# EAGLE design DSPLIT_v0.2 (EAGLE 6.5.0)
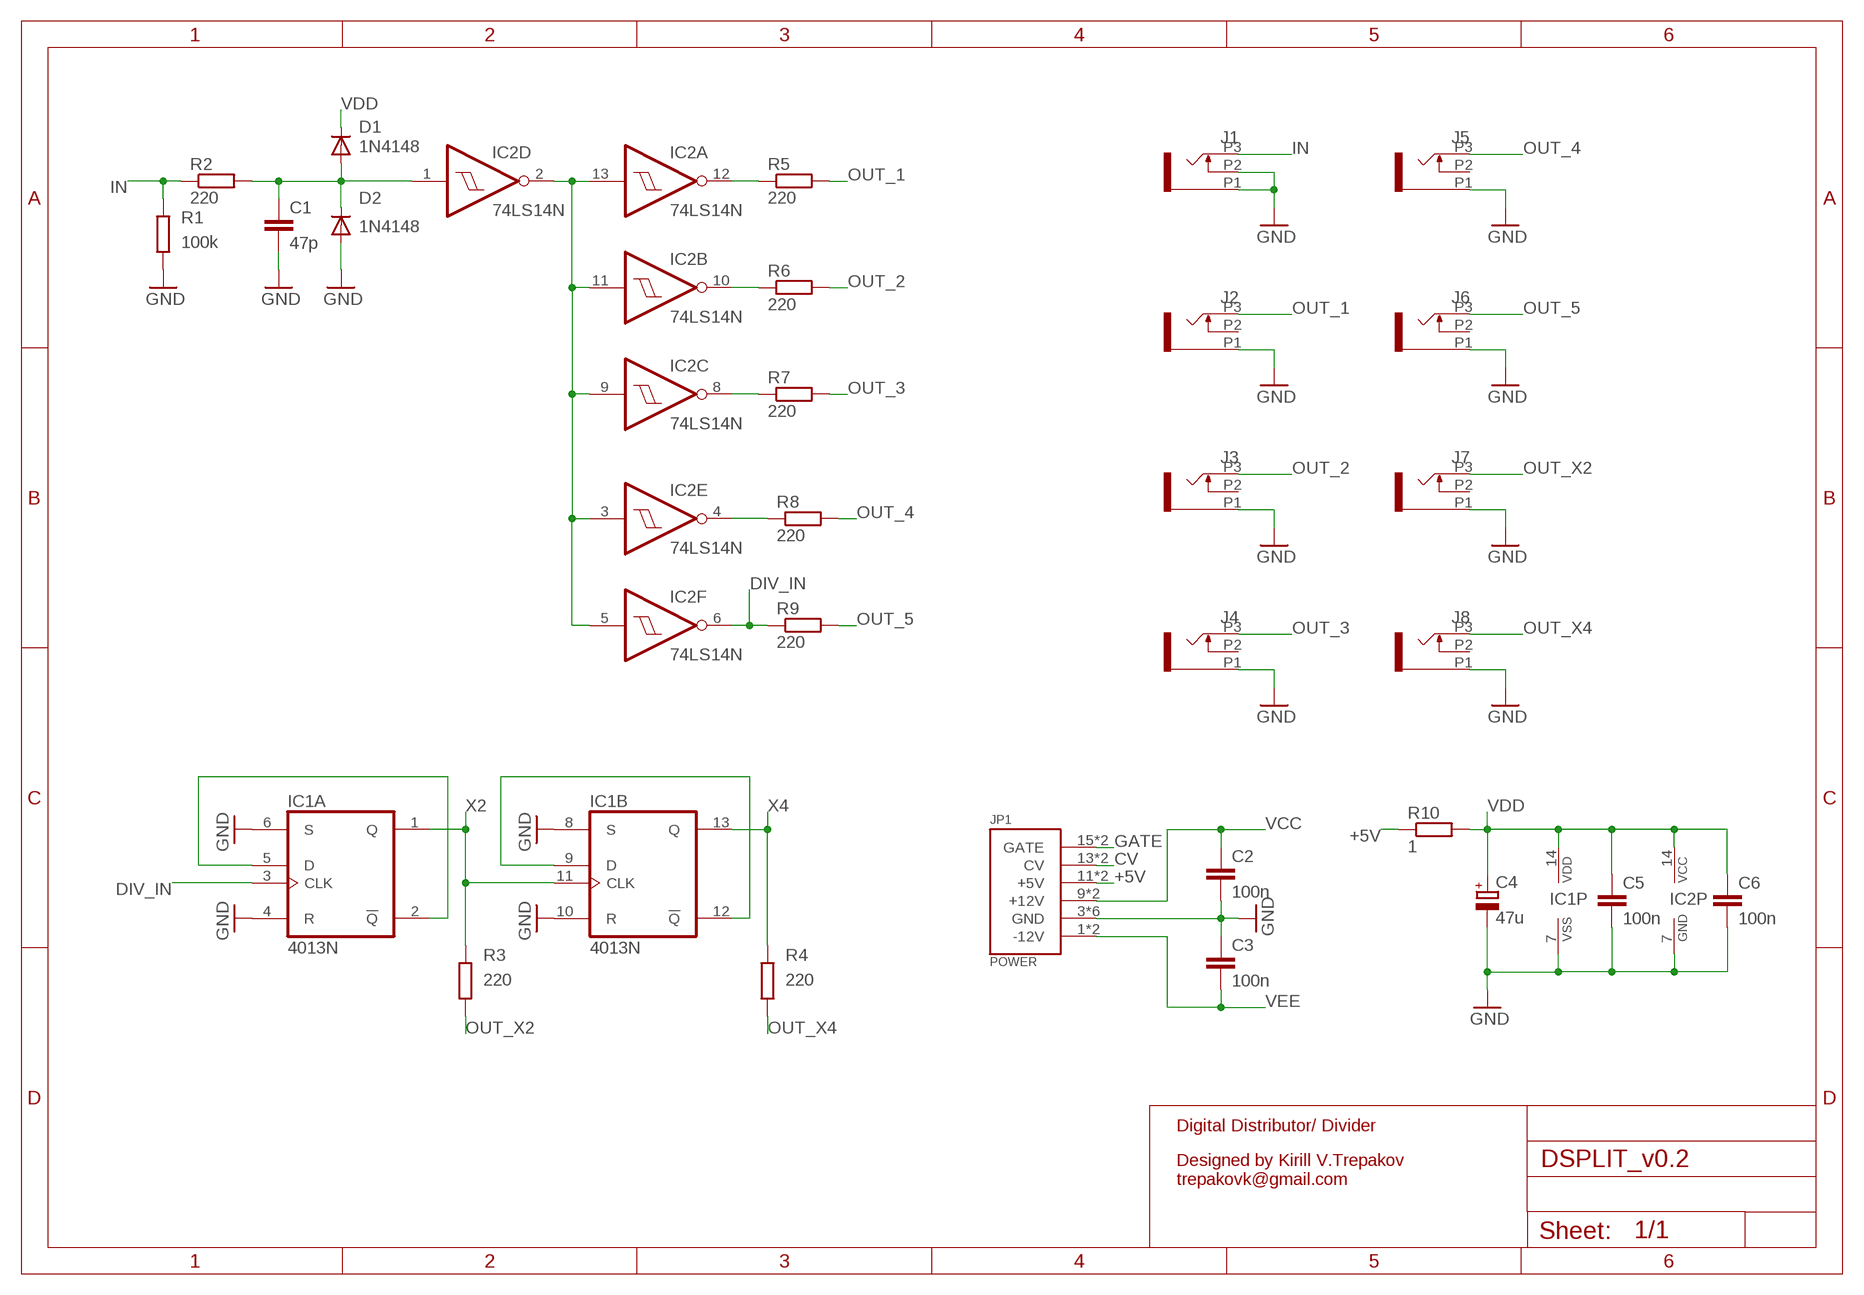
[diagram p0: schematic, sheet 1]

## Parts
C1  47p  C-EU050-024X044  [C050-024X044]
C2  100n  C-EU050-024X044  [C050-024X044]
C3  100n  C-EU050-024X044  [C050-024X044]
C4  47u  CPOL-EUE2.5-6  [E2,5-6]
C5  100n  C-EU050-024X044  [C050-024X044]
C6  100n  C-EU050-024X044  [C050-024X044]
D1  1N4148  1N4148DO35-7  [DO35-7]
D2  1N4148  1N4148DO35-7  [DO35-7]
IC1  4013N  [DIL14]
IC2  74LS14N  [DIL14]
J1  WQP-PJ302M_JACK  [WQP-PJ302M_JACK]
J2  WQP-PJ302M_JACK  [WQP-PJ302M_JACK]
J3  WQP-PJ302M_JACK  [WQP-PJ302M_JACK]
J4  WQP-PJ302M_JACK  [WQP-PJ302M_JACK]
J5  WQP-PJ302M_JACK  [WQP-PJ302M_JACK]
J6  WQP-PJ302M_JACK  [WQP-PJ302M_JACK]
J7  WQP-PJ302M_JACK  [WQP-PJ302M_JACK]
J8  WQP-PJ302M_JACK  [WQP-PJ302M_JACK]
JP1  POWER  POWER"  [POWER_16]
R1  100k  R-EU_0204/7  [0204/7]
R2  220  R-EU_0204/7  [0204/7]
R3  220  R-EU_0204/7  [0204/7]
R4  220  R-EU_0204/7  [0204/7]
R5  220  R-EU_0204/7  [0204/7]
R6  220  R-EU_0204/7  [0204/7]
R7  220  R-EU_0204/7  [0204/7]
R8  220  R-EU_0204/7  [0204/7]
R9  220  R-EU_0204/7  [0204/7]
R10  1  R-EU_0204/7  [0204/7]

## Nets
+5V: JP1.11(+5V) JP1.12(+5V) R10.1
CV: JP1.13(CV) JP1.14(CV)
DIV_IN: IC1.3(A:CLK) IC2.6(F:O) R9.1
GATE: JP1.15(GATE) JP1.16(GATE)
GND: C1.2 C2.2 C3.1 C4.- C5.2 C6.2 D2.A IC1.4(A:R) IC1.6(A:S) IC1.7(P:VSS) IC1.8(B:S) IC1.10(B:R) IC2.7(P:GND) J1.P1 J1.P2 J2.P1 J3.P1 J4.P1 J5.P1 J6.P1 J7.P1 J8.P1 JP1.3(GND) JP1.4(GND) JP1.5(GND) JP1.6(GND) JP1.7(GND) JP1.8(GND) R1.1
IN: J1.P3 R1.2 R2.1
IN_1_: C1.1 D1.A D2.C IC2.1(D:I) R2.2
N$1: IC1.2(A:!Q) IC1.5(A:D)
N$2: IC2.2(D:O) IC2.3(E:I) IC2.5(F:I) IC2.9(C:I) IC2.11(B:I) IC2.13(A:I)
N$3: IC1.9(B:D) IC1.12(B:!Q)
N$10: IC2.12(A:O) R5.1
N$11: IC2.10(B:O) R6.1
N$12: IC2.8(C:O) R7.1
N$13: IC2.4(E:O) R8.1
OUT_1: J2.P3 R5.2
OUT_2: J3.P3 R6.2
OUT_3: J4.P3 R7.2
OUT_4: J5.P3 R8.2
OUT_5: J6.P3 R9.2
OUT_X2: J7.P3 R3.2
OUT_X4: J8.P3 R4.2
VCC: C2.1 JP1.9(+12V) JP1.10(+12V)
VDD: C4.+ C5.1 C6.1 D1.C IC1.14(P:VDD) IC2.14(P:VCC) R10.2
VEE: C3.2 JP1.1(-12V) JP1.2(-12V)
X2: IC1.1(A:Q) IC1.11(B:CLK) R3.1
X4: IC1.13(B:Q) R4.1
Unconnected: J2.P2 J3.P2 J4.P2 J5.P2 J6.P2 J7.P2 J8.P2

## Notes on the sheet
- Digital Distributor/ Divider
- Designed by Kirill V.Trepakov
  trepakovk@gmail.com

## Library data of the parts
C1-C3 C5 C6 = rcl:C-EU: CAPACITOR, European symbol
C4 = rcl:CPOL-EU: POLARIZED CAPACITOR, European symbol
D1 D2 = _motovilo:1N4148: DIODE high speed (Philips)
IC1 = 40xx:4013: Dual D FLIP FLOP, set/reset
IC2 = 74xx-eu:74*14: Hex schmitt trigger INVERTER
J1-J8 = _mtvl.connectors:WQP-PJ302M_JACK
JP1 = _motovilo:POWER
R1-R10 = rcl:R-EU_: RESISTOR, European symbol

## Board
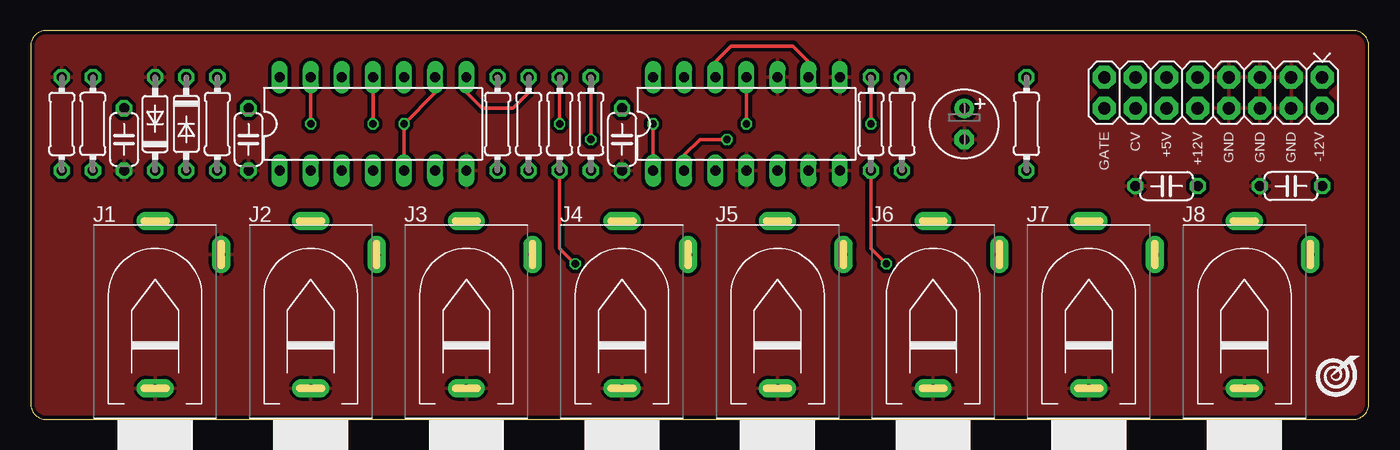
[diagram p1: board, top side]
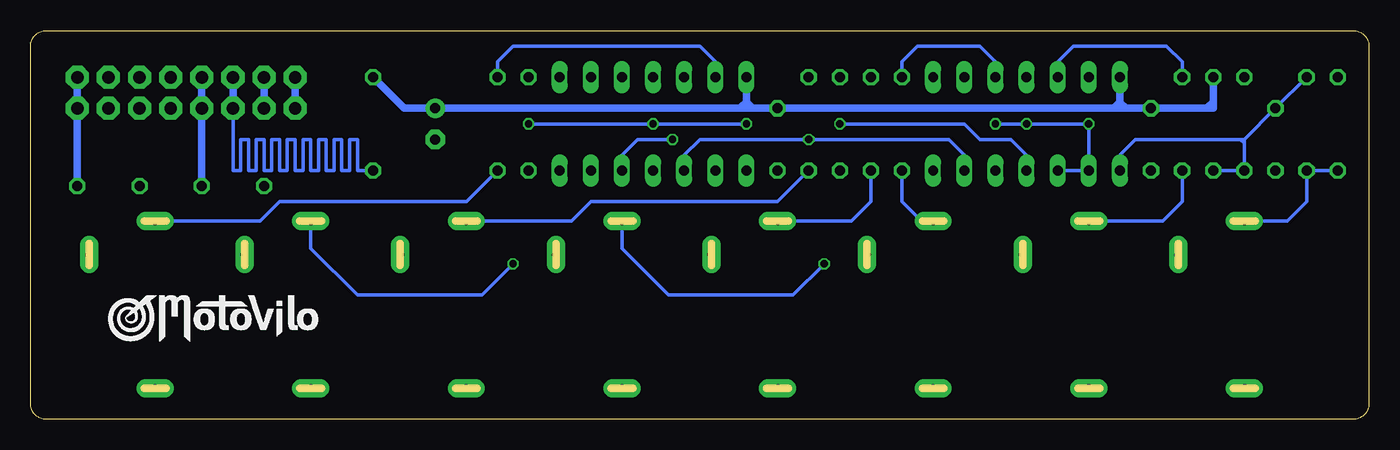
[diagram p2: board, bottom side, seen from below]

Size 109.22 x 31.75 mm. Coordinates in mm from the lower left corner, seen from the top.
Outline: 0,30.48 0,1.27 arc90 1.27,0 107.95,0 arc90 109.22,1.27 109.22,30.48 arc90 107.95,31.75 1.27,31.75 arc90 0,30.48
Copper layers (1*16): Top 0.035mm / dielectric 1.5mm / Bottom 0.035mm
Design rules "ITEADstudio_DRC_z *": minimum track width 6mil, minimum drill 12mil, track to track 10mil, track to pad 10mil, pad to pad 10mil, via to via 10mil, smd to smd 0mil, copper to edge 10mil, drill to drill 10mil, minimum pad ring 10mil, minimum via ring 6mil, stop-mask expansion 2mil, vias tented up to drill 100mil, thermal gap 10mil

### Footprints (pad centres in the part's own frame; a part is rotated, then mirrored left to right if it is on the bottom)
C050-024X044 = drill 0.813 octagon: 1 -2.54,0; 2 2.54,0
E2,5-6 = drill 0.813 pad 1.6: + -1.27,0 | drill 0.813 pad 1.6 octagon: - 1.27,0
DO35-7 = drill 0.813 octagon: A 3.81,0; C -3.81,0
DIL14 = drill 0.813 long: 1 -7.62,-3.81; 2 -5.08,-3.81; 3 -2.54,-3.81; 4 0,-3.81; 5 2.54,-3.81; 6 5.08,-3.81; 7 7.62,-3.81; 8 7.62,3.81; 9 5.08,3.81; 10 2.54,3.81; 11 0,3.81; 12 -2.54,3.81; 13 -5.08,3.81; 14 -7.62,3.81
WQP-PJ302M_JACK = drill 0.61 pad 1.524 long: P1 0,-5.08; P2 5.397,5.842; P3 0,8.572
POWER_16 = drill 1.016 pad 1.88 octagon: 1 1.27,-8.89; 2 -1.27,-8.89; 3 1.27,-6.35; 4 -1.27,-6.35; 5 1.27,-3.81; 6 -1.27,-3.81; 7 1.27,-1.27; 8 -1.27,-1.27; 9 1.27,1.27; 10 -1.27,1.27; 11 1.27,3.81; 12 -1.27,3.81; 13 1.27,6.35; 14 -1.27,6.35; 15 1.27,8.89; 16 -1.27,8.89
0204/7 = drill 0.813 octagon: 1 -3.81,0; 2 3.81,0

### Placement (x,y rotation side)
C1  7.62,22.86 270 top
C2  92.71,19.05 180 top
C3  102.87,19.05 0 top
C4  76.2,24.13 270 top
C5  17.78,22.86 270 top
C6  48.26,22.86 270 top
D1  12.7,24.13 270 top
D2  10.16,24.13 90 top
IC1  58.42,24.13 0 top
IC2  27.94,24.13 0 top
J1  10.16,7.62 0 top
J2  22.86,7.62 0 top
J3  35.56,7.62 0 top
J4  48.26,7.62 0 top
J5  60.96,7.62 0 top
J6  73.66,7.62 0 top
J7  86.36,7.62 0 top
J8  99.06,7.62 0 top
JP1  96.52,26.67 90 top
R1  2.54,24.13 270 top
R2  5.08,24.13 90 top
R3  68.58,24.13 270 top
R4  71.12,24.13 270 top
R5  15.24,24.13 270 top
R6  38.1,24.13 270 top
R7  40.64,24.13 270 top
R8  43.18,24.13 270 top
R9  45.72,24.13 270 top
R10  81.28,24.13 90 top
U$1  [LOGO_SPACE_002]  102.87,6.35 0 bottom
U$2  [LOGO_1]  104.78,1.59 0 top

### Tracks (layer width: path | path; a pad name or v marks a point on that pad's centre or on a via)
+5V
  Bottom 0.305: JP1.12 92.71,20.32 92.08,20.32 92.08,22.86 91.44,22.86 91.44,20.32 90.81,20.32 90.81,22.86 90.17,22.86 90.17,20.32 89.53,20.32 89.53,22.86 88.9,22.86 88.9,20.32 88.27,20.32 88.27,22.86 87.63,22.86 87.63,20.32 87,20.32 87,22.86 86.36,22.86 86.36,20.32 85.72,20.32 85.72,22.86 85.09,22.86 85.09,20.32 84.45,20.32 84.45,22.86 83.82,22.86 83.82,20.32 83.19,20.32 83.19,22.86 82.55,22.86 82.55,20.32 R10.1
  Bottom 0.61: JP1.12 JP1.11
CV
  Bottom 0.61: JP1.13 JP1.14
DIV_IN  (via drill 0.6)
  Top 0.305: R9.1 v45.72,22.86
  Bottom 0.305: IC2.6 33.02,21.59 34.29,22.86 v45.72,22.86 54.61,22.86 55.88,21.59 IC1.3
GATE
  Bottom 0.61: JP1.15 JP1.16
GND
  pour Top (isolate 0.305): 0,31.75 0,0 109.22,0 109.22,31.75
IN
  Bottom 0.305: R1.2 R2.1 5.08,17.78 6.67,16.19 J1.P3
IN_1_
  Bottom 0.305: R2.2 C1.1 10.16,22.86 | 10.16,22.86 10.48,22.86 | 10.48,22.86 19.05,22.86 20.32,21.59 IC2.1 | D1.A D2.C 10.16,22.54 | 10.16,22.54 10.16,22.86 | 10.48,22.86 10.16,22.54
N$1  (via drill 0.6)
  Top 0.305: v56.83,22.86 54.61,22.86 53.34,21.59 IC1.2
  Bottom 0.305: IC1.5 60.96,21.59 59.69,22.86 v56.83,22.86
N$2  (via drill 0.6)
  Top 0.305: v27.94,24.13 IC2.11 | IC2.13 v22.86,24.13 | IC2.5 v30.48,24.13 33.02,26.67 IC2.9
  Bottom 0.305: v30.48,24.13 v27.94,24.13 v22.86,24.13 IC2.2 IC2.3
N$3
  Top 0.305: IC1.9 63.5,29.21 62.23,30.48 57.15,30.48 55.88,29.21 IC1.12
N$10
  Bottom 0.305: R5.1 15.24,29.21 16.51,30.48 24.13,30.48 25.4,29.21 IC2.12
N$11
  Bottom 0.305: R6.1 38.1,29.21 36.83,30.48 31.75,30.48 30.48,29.21 IC2.10
N$12
  Top 0.305: IC2.8 35.56,26.67 36.83,25.4 39.37,25.4 40.64,26.67 R7.1
N$13  (via drill 0.6)
  Top 0.305: R8.1 v43.18,24.13
  Bottom 0.305: v43.18,24.13 33.02,24.13 31.75,22.86 29.21,22.86 27.94,21.59 IC2.4
OUT_1
  Bottom 0.305: J2.P3 16.83,16.19 15.24,17.78 R5.2
OUT_2
  Bottom 0.305: J3.P3 36.51,16.19 38.1,17.78 R6.2
OUT_3
  Bottom 0.305: J4.P3 42.23,16.19 40.64,17.78 R7.2
OUT_4  (via drill 0.6)
  Top 0.305: v44.45,12.7 43.18,13.97 R8.2
  Bottom 0.305: J5.P3 60.96,13.97 57.15,10.16 46.99,10.16 v44.45,12.7
OUT_5
  Bottom 0.305: J6.P3 65.09,16.19 63.5,17.78 48.26,17.78 R9.2
OUT_X2  (via drill 0.6)
  Top 0.305: v69.85,12.7 68.58,13.97 R3.2
  Bottom 0.305: J7.P3 86.36,13.97 82.55,10.16 72.39,10.16 v69.85,12.7
OUT_X4
  Bottom 0.305: R4.2 73.66,17.78 88.9,17.78 90.49,16.19 J8.P3
VCC
  Bottom 0.61: JP1.9 JP1.10 C2.1
VDD
  Bottom 0.406: 19.68,25.4 20.32,26.04 20.95,25.4 | 12.7,26.04 13.34,25.4 | 50.16,25.4 50.8,26.04 51.44,25.4
  Bottom 0.61: D1.C 12.7,26.04 12.7,25.4 13.34,25.4 C5.1 19.68,25.4 20.32,25.4 | 20.32,25.4 20.95,25.4 C6.1 50.16,25.4 50.8,25.4 | 50.8,25.4 51.44,25.4 C4.+ 78.74,25.4 R10.2 | IC1.14 50.8,26.04 50.8,25.4 | IC2.14 20.32,26.04 20.32,25.4
VEE
  Bottom 0.61: JP1.1 JP1.2 C3.2
X2  (via drill 0.6)
  Top 0.305: IC1.11 v58.42,24.13 | v50.8,24.13 IC1.1 | R3.1 v68.58,24.13
  Bottom 0.305: v50.8,24.13 v58.42,24.13 v68.58,24.13
X4
  Bottom 0.305: IC1.13 53.34,29.21 54.61,30.48 69.85,30.48 71.12,29.21 R4.1

### Text on the board
tValues: dSPLIT v.0.2
bDocu: 5-way digital splitter, x2, x4 divider with EMI filtering and input debouncing